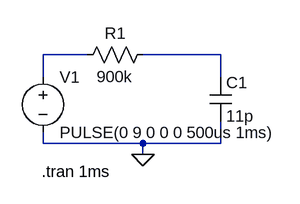
[diagram p0: schematic Gate loading test.asc]
Gate loading test.asc, the LTspice schematic file:
Version 4
SHEET 1 880 680
WIRE 224 96 160 96
WIRE 416 96 304 96
WIRE 160 128 160 96
WIRE 416 128 416 96
WIRE 160 224 160 208
WIRE 304 224 160 224
WIRE 416 224 416 192
WIRE 416 224 304 224
WIRE 304 240 304 224
FLAG 304 240 0
SYMBOL res 320 80 R90
WINDOW 0 0 56 VBottom 2
WINDOW 3 32 56 VTop 2
SYMATTR InstName R1
SYMATTR Value 900k
SYMBOL cap 400 128 R0
SYMATTR InstName C1
SYMATTR Value 11p
SYMBOL voltage 160 112 R0
WINDOW 123 0 0 Left 0
WINDOW 39 0 0 Left 0
SYMATTR InstName V1
SYMATTR Value PULSE(0 9 0 0 0 500us 1ms)
TEXT 158 264 Left 2 !.tran 1ms

The netlist it stands for:
* Gate loading test.asc
R1 N002 N001 900k
C1 N002 0 11p
V1 N001 0 PULSE(0 9 0 0 0 500us 1ms)
.tran 1ms
.backanno
.end